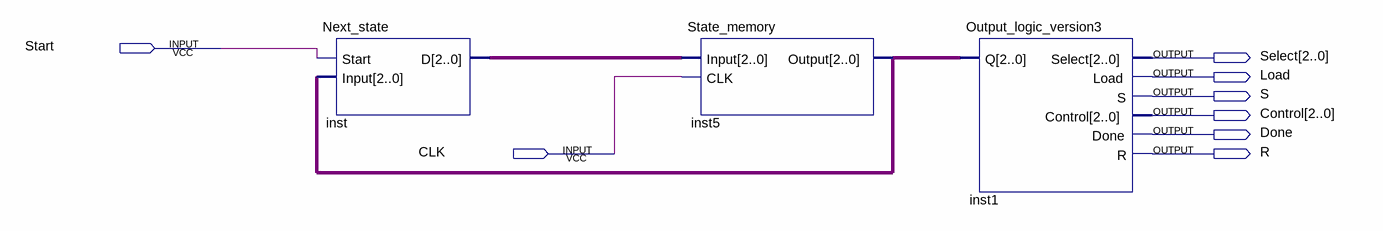
[diagram p0: schematic sheet]
// Quartus schematic Controller_version3.bdf as structural Verilog: 3 symbols, 8 pins
module Controller_version3 (
  input  Start,
  input  CLK,
  output [2:0] Select,
  output Load,
  output S,
  output [2:0] Control,
  output Done,
  output R
);

  wire [2:0] inst5_output, inst_d;

  Next_state inst (.Start(Start), .Input(inst5_output), .D(inst_d));
  State_memory inst5 (.Input(inst_d), .CLK(CLK), .Output(inst5_output));
  Output_logic_version3 inst1 (
    .Q(inst5_output), .Select(Select), .Load(Load), .S(S), .Control(Control), .Done(Done), .R(R));
endmodule
